# EAGLE design Cpu_digout_mega128 (EAGLE 4.11)
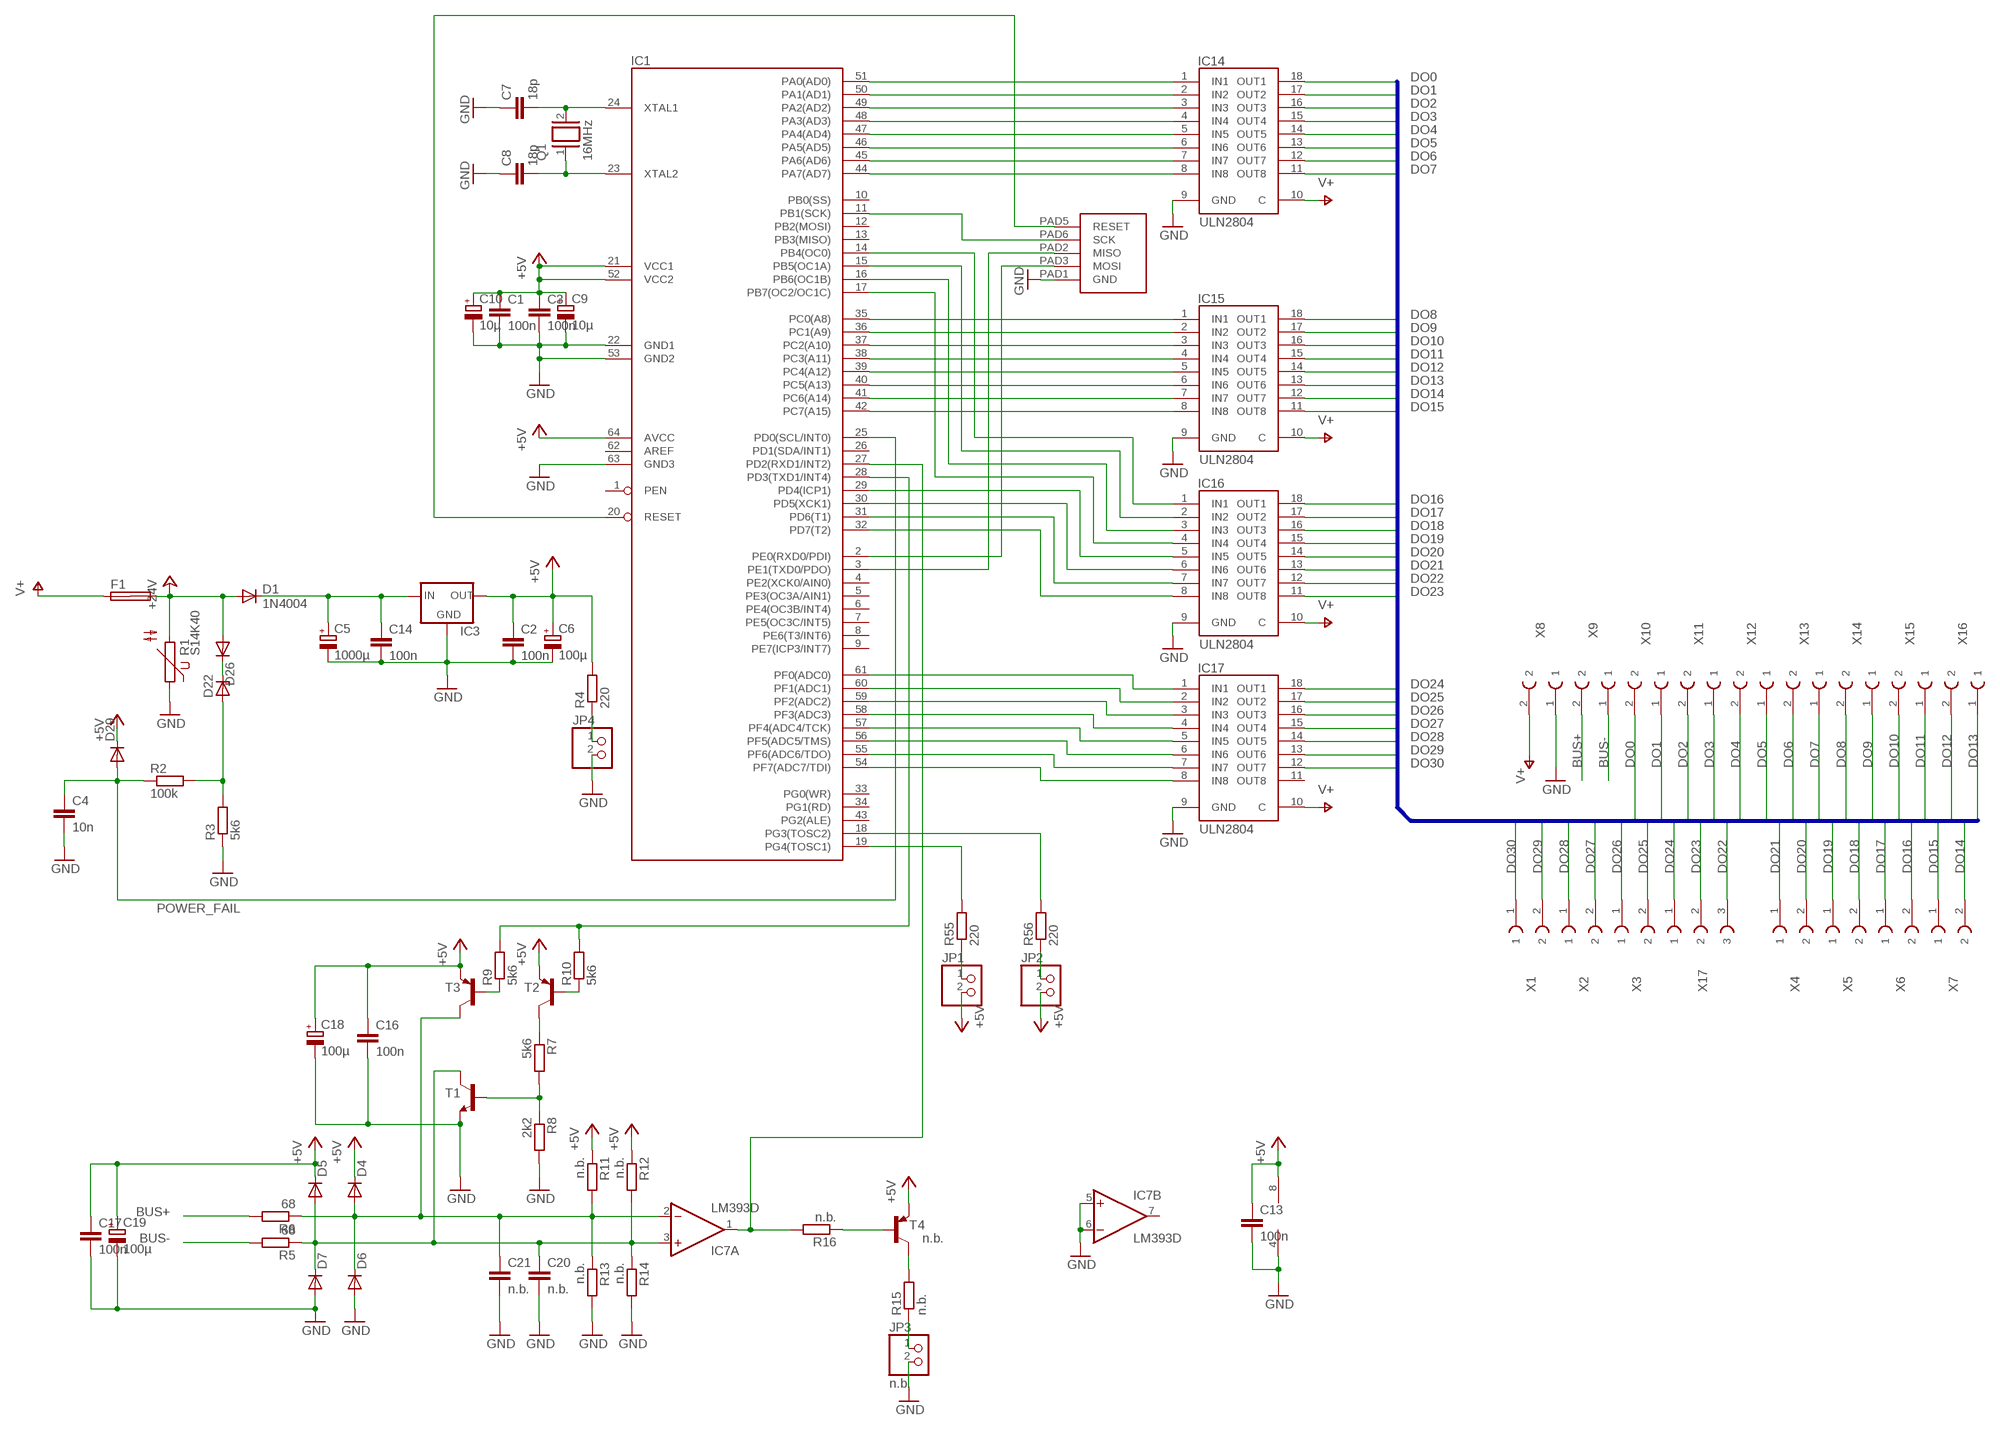
[diagram p0: schematic, sheet 1]

## Parts
C1  100n  C-EU050-024X044  [C050-024X044]
C2  100n  C-EU050-024X044  [C050-024X044]
C3  100n  C-EU050-024X044  [C050-024X044]
C4  10n  C-EU050-024X044  [C050-024X044]
C5  1000µ  CPOL-EUE5-13  [E5-13]
C6  100µ  CPOL-EUE2.5-6  [E2,5-6]
C7  18p  C-EU025-024X044  [C025-024X044]
C8  18p  C-EU025-024X044  [C025-024X044]
C9  10µ  CPOL-EUE2-5  [E2-5]
C10  10µ  CPOL-EUE2-5  [E2-5]
C13  100n  C-EU050-024X044  [C050-024X044]
C14  100n  C-EU050-024X044  [C050-024X044]
C16  100n  C-EU050-024X044  [C050-024X044]
C17  100n  C-EU050-024X044  [C050-024X044]
C18  100µ  CPOL-EUE2.5-6  [E2,5-6]
C19  100µ  CPOL-EUE2.5-6  [E2,5-6]
C20  n.b.  C-EU050-024X044  [C050-024X044]
C21  n.b.  C-EU050-024X044  [C050-024X044]
D1  1N4004  [DO41-10]
D4  DIODE-D-2.5  [D-2.5]
D5  DIODE-D-2.5  [D-2.5]
D6  DIODE-D-2.5  [D-2.5]
D7  DIODE-D-2.5  [D-2.5]
D22  ZENER-DIODEZD-2.5  [ZDIO-2.5]
D26  DIODE-D-2.5  [D-2.5]
D29  DIODE-D-2.5  [D-2.5]
F1  SHK20L  [SHK20L]
IC1  ATMEGA128  [TQFP64]
IC3  7805  [TO220V]
IC7  LM393D  [SO08]
IC14  ULN2804  ULN2801  [DIL18]
IC15  ULN2804  ULN2801  [DIL18]
IC16  ULN2804  ULN2801  [DIL18]
IC17  ULN2804  ULN2801  [DIL18]
JP1  PINHD-1X2  [1X02]
JP2  PINHD-1X2  [1X02]
JP3  n.b.  PINHD-1X2  [1X02]
JP4  PINHD-1X2  [1X02]
Q1  16MHz  XTAL/S  [QS]
R1  S14K40  [S14K40]
R2  100k  R-EU_0207/2V  [0207/2V]
R3  5k6  R-EU_0207/2V  [0207/2V]
R4  220  R-EU_0207/2V  [0207/2V]
R5  68  R-EU_0207/2V  [0207/2V]
R6  68  R-EU_0207/2V  [0207/2V]
R7  5k6  R-EU_0207/2V  [0207/2V]
R8  2k2  R-EU_0207/2V  [0207/2V]
R9  5k6  R-EU_0207/2V  [0207/2V]
R10  5k6  R-EU_0207/2V  [0207/2V]
R11  n.b.  R-EU_0207/2V  [0207/2V]
R12  n.b.  R-EU_0207/2V  [0207/2V]
R13  n.b.  R-EU_0207/2V  [0207/2V]
R14  n.b.  R-EU_0207/2V  [0207/2V]
R15  n.b.  R-EU_0207/2V  [0207/2V]
R16  n.b.  R-EU_0207/2V  [0207/2V]
R55  220  R-EU_0207/2V  [0207/2V]
R56  220  R-EU_0207/2V  [0207/2V]
T1  BC546A-NPN-TO92-EBC  [TO92-EBC]
T2  BC556A-PNP-TO92-EBC  [TO92-EBC]
T3  BC556A-PNP-TO92-EBC  [TO92-EBC]
T4  n.b.  BC556A-PNP-TO92-EBC  [TO92-EBC]
U$1  ATMEL_ISP  [ATMEL_ISP]
X1  AR-KLEMME_508_2POL  [W237-2E]
X2  AR-KLEMME_508_2POL  [W237-2E]
X3  AR-KLEMME_508_2POL  [W237-2E]
X4  AR-KLEMME_508_2POL  [W237-2E]
X5  AR-KLEMME_508_2POL  [W237-2E]
X6  AR-KLEMME_508_2POL  [W237-2E]
X7  AR-KLEMME_508_2POL  [W237-2E]
X8  AR-KLEMME_508_2POL  [W237-2E]
X9  AR-KLEMME_508_2POL  [W237-2E]
X10  AR-KLEMME_508_2POL  [W237-2E]
X11  AR-KLEMME_508_2POL  [W237-2E]
X12  AR-KLEMME_508_2POL  [W237-2E]
X13  AR-KLEMME_508_2POL  [W237-2E]
X14  AR-KLEMME_508_2POL  [W237-2E]
X15  AR-KLEMME_508_2POL  [W237-2E]
X16  AR-KLEMME_508_2POL  [W237-2E]
X17  AR-KLEMME_508_3POL  [W237-3E]

## Nets
+5V: C1.1 C2.1 C3.1 C6.+ C9.+ C10.+ C13.1 C16.1 C17.1 C18.+ C19.+ D4.C D5.C D29.C IC1.21(VCC1) IC1.52(VCC2) IC1.64(AVCC) IC3.3(OUT) IC7.8(P:V+) JP1.2 JP2.2 R4.2 R11.1 R12.1 T2.E T3.E T4.E
+24V: D1.A D26.A F1.2A R1.2
/RESET: IC1.20(RESET) U$1.PAD5(RESET)
B+: C21.1 D4.A D6.C IC7.2(A:-IN) R6.1 R11.2 R13.1 T3.C
B-: C20.1 D5.A D7.C IC7.3(A:+IN) R5.1 R12.2 R14.1 T1.C
BUS+: R6.2 X9.2
BUS-: R5.2 X9.1
DAC0: IC1.51(PA0(AD0)) IC14.1(IN1)
DAC1: IC1.50(PA1(AD1)) IC14.2(IN2)
DAC2: IC1.49(PA2(AD2)) IC14.3(IN3)
DAC3: IC1.48(PA3(AD3)) IC14.4(IN4)
DAC4: IC1.47(PA4(AD4)) IC14.5(IN5)
DAC5: IC1.46(PA5(AD5)) IC14.6(IN6)
DAC6: IC1.45(PA6(AD6)) IC14.7(IN7)
DAC7: IC1.44(PA7(AD7)) IC14.8(IN8)
DO0: IC14.18(OUT1) X10.2
DO1: IC14.17(OUT2) X10.1
DO2: IC14.16(OUT3) X11.2
DO3: IC14.15(OUT4) X11.1
DO4: IC14.14(OUT5) X12.2
DO5: IC14.13(OUT6) X12.1
DO6: IC14.12(OUT7) X13.2
DO7: IC14.11(OUT8) X13.1
DO8: IC15.18(OUT1) X14.2
DO9: IC15.17(OUT2) X14.1
DO10: IC15.16(OUT3) X15.2
DO11: IC15.15(OUT4) X15.1
DO12: IC15.14(OUT5) X16.2
DO13: IC15.13(OUT6) X16.1
DO14: IC15.12(OUT7) X7.2
DO15: IC15.11(OUT8) X7.1
DO16: IC16.18(OUT1) X6.2
DO17: IC16.17(OUT2) X6.1
DO18: IC16.16(OUT3) X5.2
DO19: IC16.15(OUT4) X5.1
DO20: IC16.14(OUT5) X4.2
DO21: IC16.13(OUT6) X4.1
DO22: IC16.12(OUT7) X17.3
DO23: IC16.11(OUT8) X17.2
DO24: IC17.18(OUT1) X17.1
DO25: IC17.17(OUT2) X3.2
DO26: IC17.16(OUT3) X3.1
DO27: IC17.15(OUT4) X2.2
DO28: IC17.14(OUT5) X2.1
DO29: IC17.13(OUT6) X1.2
DO30: IC17.12(OUT7) X1.1
GND: C1.2 C2.2 C3.2 C4.2 C5.- C6.- C7.1 C8.1 C9.- C10.- C13.2 C14.2 C16.2 C17.2 C18.- C19.- C20.2 C21.2 D6.A D7.A IC1.22(GND1) IC1.53(GND2) IC1.63(GND3) IC3.2(GND) IC7.4(P:V-) IC7.5(B:+IN) IC7.6(B:-IN) IC14.9(GND) IC15.9(GND) IC16.9(GND) IC17.9(GND) JP3.2 JP4.2 R1.1 R3.1 R8.2 R13.2 R14.2 T1.E U$1.PAD1(GND) X8.1
MISO: IC1.3(PE1(TXD0/PDO)) U$1.PAD2(MISO)
MOSI: IC1.2(PE0(RXD0/PDI)) U$1.PAD3(MOSI)
N$1: JP4.1 R4.1
N$2: D22.C D26.C
N$3: D22.A R2.2 R3.2
N$4: C7.2 IC1.24(XTAL1) Q1.2
N$5: IC1.14(PB4(OC0)) IC16.1(IN1)
N$6: C8.2 IC1.23(XTAL2) Q1.1
N$13: R16.1 T4.B
N$14: R15.2 T4.C
N$15: C5.+ C14.1 D1.C IC3.1(IN)
N$16: R10.1 T2.B
N$17: R9.1 T3.B
N$18: R7.1 T2.C
N$19: R7.2 R8.1 T1.B
N$20: IC1.15(PB5(OC1A)) IC16.2(IN2)
N$21: IC1.16(PB6(OC1B)) IC16.3(IN3)
N$22: IC1.17(PB7(OC2/OC1C)) IC16.4(IN4)
N$24: JP3.1 R15.1
N$28: IC1.29(PD4(ICP1)) IC16.5(IN5)
N$29: IC1.30(PD5(XCK1)) IC16.6(IN6)
N$30: IC1.31(PD6(T1)) IC16.7(IN7)
N$31: IC1.32(PD7(T2)) IC16.8(IN8)
N$32: IC1.61(PF0(ADC0)) IC17.1(IN1)
N$33: IC1.60(PF1(ADC1)) IC17.2(IN2)
N$34: IC1.59(PF2(ADC2)) IC17.3(IN3)
N$35: IC1.58(PF3(ADC3)) IC17.4(IN4)
N$36: IC1.57(PF4(ADC4/TCK)) IC17.5(IN5)
N$37: IC1.56(PF5(ADC5/TMS)) IC17.6(IN6)
N$42: IC1.55(PF6(ADC6/TDO)) IC17.7(IN7)
N$43: IC1.54(PF7(ADC7/TDI)) IC17.8(IN8)
N$70: IC1.35(PC0(A8)) IC15.1(IN1)
N$71: IC1.36(PC1(A9)) IC15.2(IN2)
N$72: IC1.37(PC2(A10)) IC15.3(IN3)
N$73: IC1.38(PC3(A11)) IC15.4(IN4)
N$74: IC1.39(PC4(A12)) IC15.5(IN5)
N$75: IC1.40(PC5(A13)) IC15.6(IN6)
N$76: IC1.41(PC6(A14)) IC15.7(IN7)
N$77: IC1.42(PC7(A15)) IC15.8(IN8)
N$113: JP1.1 R55.1
N$114: JP2.1 R56.1
N$115: IC1.19(PG4(TOSC1)) R55.2
N$116: IC1.18(PG3(TOSC2)) R56.2
POWER_FAIL: C4.1 D29.A IC1.25(PD0(SCL/INT0)) R2.1
RXD: IC1.27(PD2(RXD1/INT2)) IC7.1(A:OUT) R16.2
SCK: IC1.11(PB1(SCK)) U$1.PAD6(SCK)
TXD: IC1.28(PD3(TXD1/INT4)) R9.2 R10.2
V+: F1.1A IC14.10(C) IC15.10(C) IC16.10(C) IC17.10(C) X8.2
Unconnected: F1.1B F1.2B IC1.1(PEN) IC1.4(PE2(XCK0/AIN0)) IC1.5(PE3(OC3A/AIN1)) IC1.6(PE4(OC3B/INT4)) IC1.7(PE5(OC3C/INT5)) IC1.8(PE6(T3/INT6)) IC1.9(PE7(ICP3/INT7)) IC1.10(PB0(SS)) IC1.12(PB2(MOSI)) IC1.13(PB3(MISO)) IC1.26(PD1(SDA/INT1)) IC1.33(PG0(WR)) IC1.34(PG1(RD)) IC1.43(PG2(ALE)) IC7.7(B:OUT) IC17.11(OUT8)

## Buses
B$1

## Power pins joined to a net without a drawn wire
AREF: IC1.62(AREF)

## Library data of the parts
C1-C4 C7 C8 C13 C14 C16 C17 C20 C21 = rcl:C-EU: CAPACITOR, European symbol
C5 C6 C9 C10 C18 C19 = rcl:CPOL-EU: POLARIZED CAPACITOR, European symbol
D1 = diode:1N4004: DIODE general purpose rectifier, 1 A
D4-D7 D26 D29 = diode:DIODE-: DIODE
D22 = diode:ZENER-DIODE: Z-Diode
F1 = fuse:SHK20L: FUSE HOLDER 5 x 20 mm, SH contact, SHH1 Schukat, E1073 Buerklin
IC1 = mylib:ATMEGA128
IC3 = mylib:7805
IC7 = linear:LM393: COMPARATOR
IC14-IC17 = mylib:ULN2801
JP1-JP4 = pinhead:PINHD-1X2: PIN HEADER
Q1 = special:XTAL/S: CRYSTAL
R1 = varistor:S14K40: VARISTOR
R2-R16 R55 R56 = rcl:R-EU_: RESISTOR, European symbol
T1 = transistor:*-NPN-: NPN Transistror
T2-T4 = transistor:*-PNP-: PNP Transistror
U$1 = mylib:ATMEL_ISP
X1-X16 = mylib:AR-KLEMME_508_2POL
X17 = mylib:AR-KLEMME_508_3POL

## Board
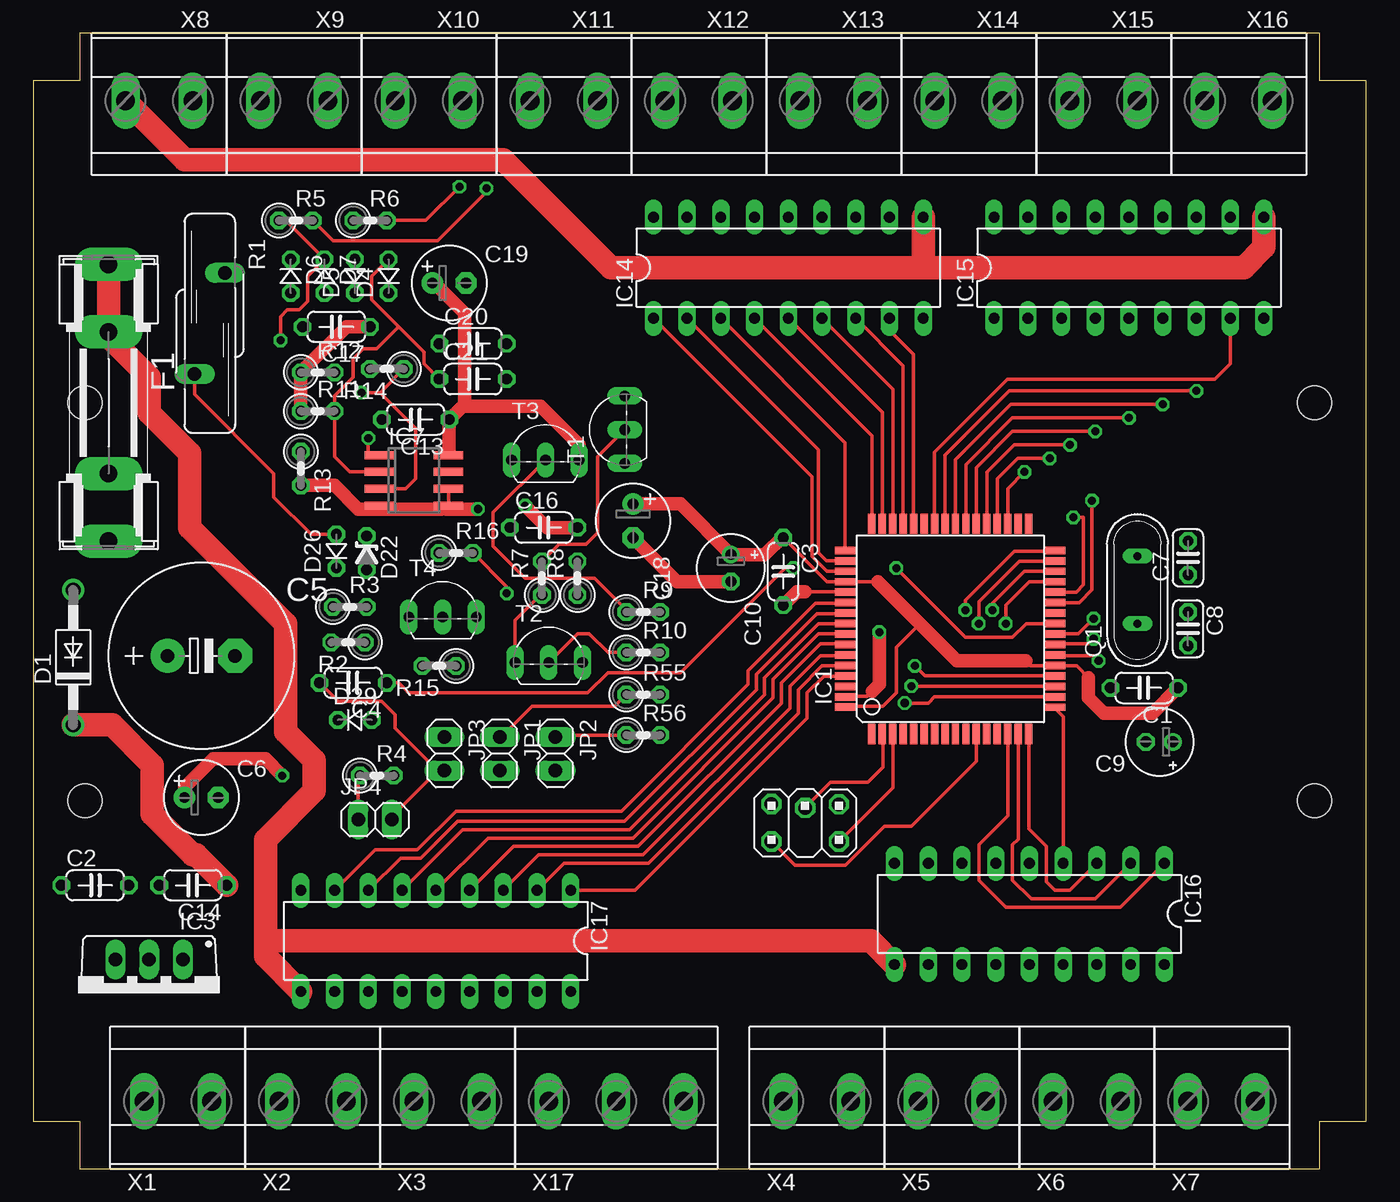
[diagram p1: board, top side]
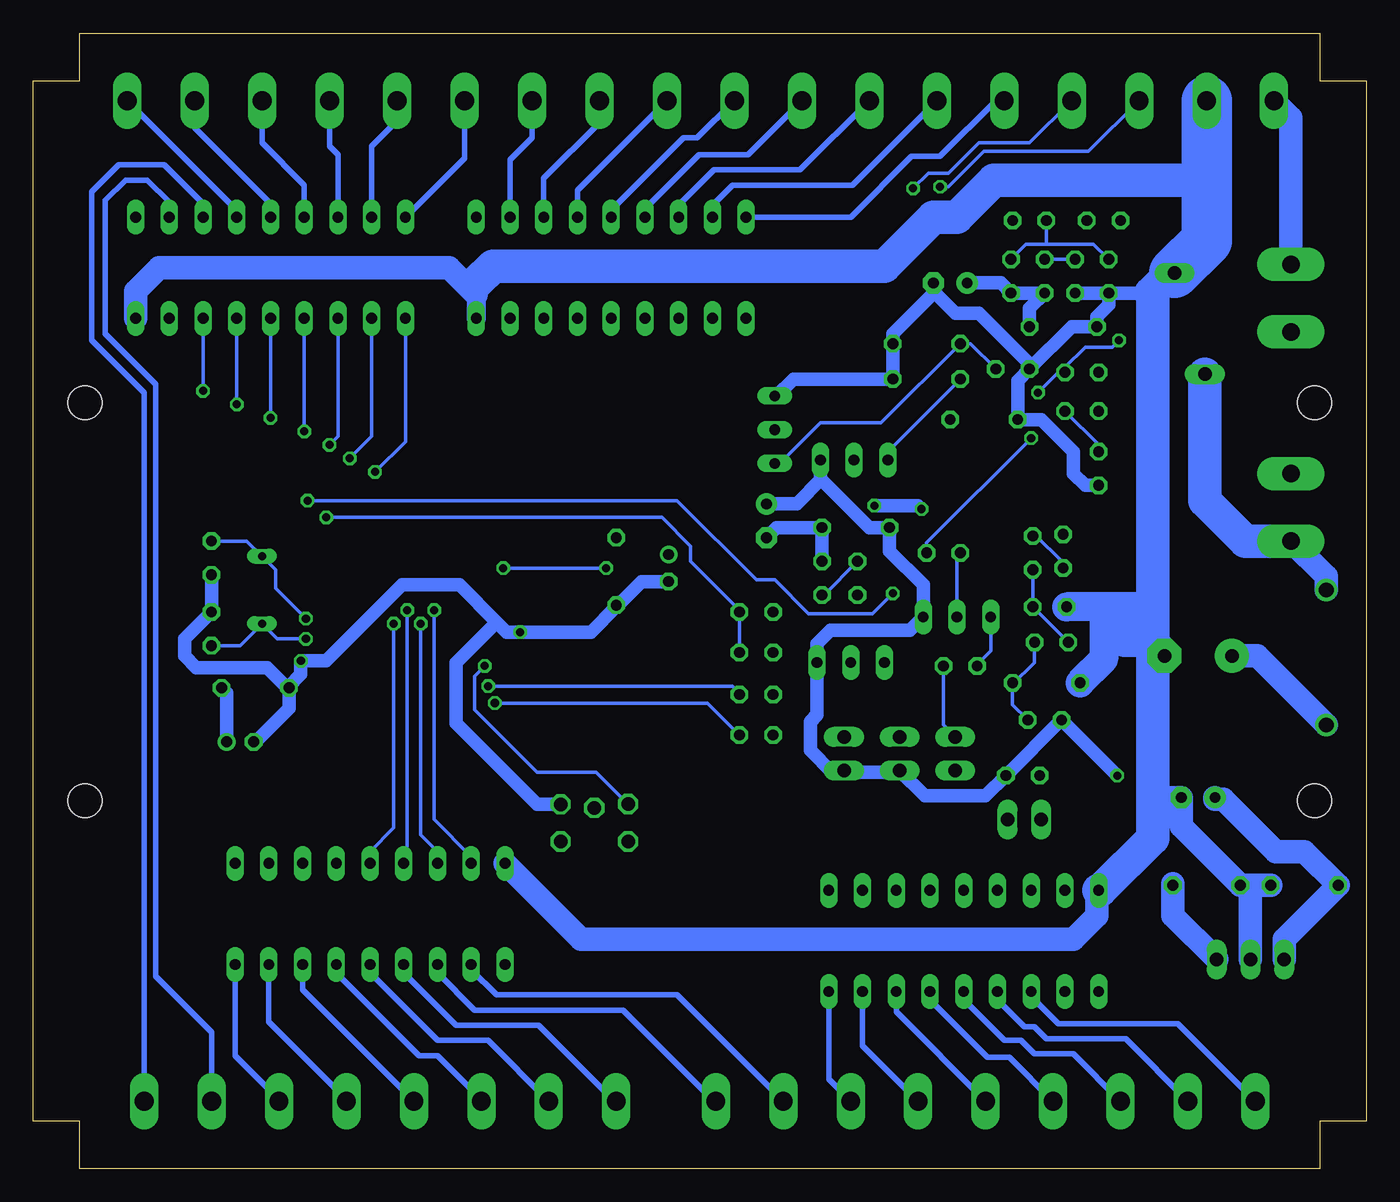
[diagram p2: board, bottom side, seen from below]

Size 100.38 x 85.47 mm. Coordinates in mm from the lower left corner, seen from the top.
Outline: 0,3.56 3.52,3.56 3.52,0 96.86,0 96.86,3.56 100.38,3.56 100.38,81.91 96.86,81.91 96.86,85.47 3.52,85.47 3.52,81.91 0,81.91 0,3.56
Copper layers (1*16): Top 0.035mm / dielectric 1.5mm / Bottom 0.035mm
Design rules "default": minimum track width 10mil, minimum drill 24mil, track to track 8mil, track to pad 8mil, pad to pad 8mil, via to via 8mil, smd to smd 8mil, copper to edge 40mil, drill to drill 8mil, minimum pad ring 10mil, minimum via ring 8mil, stop-mask expansion 4mil, vias tented up to drill 0mil, thermal gap 10mil
Holes 2.54 mm at 96.48,57.66 96.48,27.69 3.9,57.66 3.9,27.69

### Footprints (pad centres in the part's own frame; a part is rotated, then mirrored left to right if it is on the bottom)
C050-024X044 = drill 0.813 octagon: 1 -2.54,0; 2 2.54,0
E5-13 = drill 1.016 pad 2.54 round: + -2.54,0 | drill 1.016 pad 2.54 octagon: - 2.54,0
E2,5-6 = drill 0.813 pad 1.6 round: + -1.27,0 | drill 0.813 pad 1.6 octagon: - 1.27,0
C025-024X044 = drill 0.813 octagon: 1 -1.27,0; 2 1.27,0
E2-5 = drill 0.813 pad 1.27 round: + -1.016,0 | drill 0.813 pad 1.27 octagon: - 1.016,0
DO41-10 = drill 1.118 round: A 5.08,0; C -5.08,0
D-2.5 = drill 0.813 octagon: A 1.27,0; C -1.27,0
ZDIO-2.5 = drill 0.813 octagon: A 1.27,0; C -1.27,0
SHK20L = drill 1.321 pad 2.54 long: 1A -10.414,0; 1B -5.334,0; 2A 10.414,0; 2B 5.334,0
TQFP64 = smd 1.524 x 0.559: 1 -7.912,5.905; 2 -7.912,5.118; 3 -7.912,4.331; 4 -7.912,3.543; 5 -7.912,2.756; 6 -7.912,1.968; 7 -7.912,1.181; 8 -7.912,0.394; 9 -7.912,-0.394; 10 -7.912,-1.181; 11 -7.912,-1.968; 12 -7.912,-2.756; 13 -7.912,-3.543; 14 -7.912,-4.331; 15 -7.912,-5.118; 16 -7.912,-5.905; 33 7.912,-5.905; 34 7.912,-5.118; 35 7.912,-4.331; 36 7.912,-3.543; 37 7.912,-2.756; 38 7.912,-1.968; 39 7.912,-1.181; 40 7.912,-0.394; 41 7.912,0.394; 42 7.912,1.181; 43 7.912,1.968; 44 7.912,2.756; 45 7.912,3.543; 46 7.912,4.331; 47 7.912,5.118; 48 7.912,5.905 | smd 0.559 x 1.524: 17 -5.905,-7.912; 18 -5.118,-7.912; 19 -4.331,-7.912; 20 -3.543,-7.912; 21 -2.756,-7.912; 22 -1.968,-7.912; 23 -1.181,-7.912; 24 -0.394,-7.912; 25 0.394,-7.912; 26 1.181,-7.912; 27 1.968,-7.912; 28 2.756,-7.912; 29 3.543,-7.912; 30 4.331,-7.912; 31 5.118,-7.912; 32 5.905,-7.912; 49 5.905,7.912; 50 5.118,7.912; 51 4.331,7.912; 52 3.543,7.912; 53 2.756,7.912; 54 1.968,7.912; 55 1.181,7.912; 56 0.394,7.912; 57 -0.394,7.912; 58 -1.181,7.912; 59 -1.968,7.912; 60 -2.756,7.912; 61 -3.543,7.912; 62 -4.331,7.912; 63 -5.118,7.912; 64 -5.88,7.912
TO220V = drill 1.016 long: 1 -2.54,-2.54; 2 0,-2.54; 3 2.54,-2.54
SO08 = smd 0.6 x 2.2: 1 -1.905,-2.6; 2 -0.635,-2.6; 3 0.635,-2.6; 4 1.905,-2.6; 5 1.905,2.6; 6 0.635,2.6; 7 -0.635,2.6; 8 -1.905,2.6
DIL18 = drill 0.813 long: 1 -10.16,-3.81; 2 -7.62,-3.81; 3 -5.08,-3.81; 4 -2.54,-3.81; 5 0,-3.81; 6 2.54,-3.81; 7 5.08,-3.81; 8 7.62,-3.81; 9 10.16,-3.81; 10 10.16,3.81; 11 7.62,3.81; 12 5.08,3.81; 13 2.54,3.81; 14 0,3.81; 15 -2.54,3.81; 16 -5.08,3.81; 17 -7.62,3.81; 18 -10.16,3.81
1X02 = drill 1.016 long: 1 -1.27,0; 2 1.27,0
QS = drill 0.61 long: 1 -2.54,0; 2 2.54,0
S14K40 = drill 1.016 long: 1 -1.143,-3.81; 2 1.143,3.81
0207/2V = drill 0.813 octagon: 1 -1.27,0; 2 1.27,0
TO92-EBC = drill 0.813 long: B 0,-1.27; C -2.54,-1.27; E 2.54,-1.27
ATMEL_ISP = drill 1.016 octagon: PAD1 1.397,-2.54; PAD2 -1.41,-2.54; PAD3 1.13,0; PAD5 1.41,2.54; PAD6 -1.41,2.54
W237-2E = drill 1.422 long: 1 -2.54,0; 2 2.54,0
W237-3E = drill 1.422 long: 1 -5.08,0; 2 0,0; 3 5.08,0

### Placement (x,y rotation side)
C1  83.66,36.2 180 top
C2  4.66,21.34 0 top
C3  56.48,44.96 270 top
C4  24.09,36.58 180 top
C5  12.66,38.61 0 top
C6  12.66,27.94 0 top
C7  86.96,45.97 90 top
C8  86.96,40.64 270 top
C9  84.8,32.13 180 top
C10  52.54,45.21 270 top
C13  28.79,56.39 180 top
C14  12.03,21.34 180 top
C16  38.44,48.26 0 top
C17  22.82,63.37 180 top
C18  45.17,48.77 270 top
C19  31.33,66.67 0 top
C20  33.11,62.1 0 top
C21  33.11,59.44 0 top
D1  3.01,38.48 90 top
D4  26.76,67.18 90 top
D5  24.22,67.18 90 top
D6  19.39,67.18 270 top
D7  21.93,67.18 270 top
D22  25.11,46.35 270 top
D26  22.82,46.48 90 top
D29  24.22,33.78 0 top
F1  5.68,57.66 270 top
IC1  69.05,40.64 90 top
IC3  8.72,13.21 180 top
IC7  28.66,51.82 270 top
IC14  56.86,67.82 0 top
IC15  82.51,67.82 0 top
IC16  75.02,19.18 180 top
IC17  30.32,17.14 180 top
JP1  35.14,31.24 270 top
JP2  39.33,31.24 270 top
JP3  30.95,31.24 270 top
JP4  25.74,26.29 0 top
Q1  83.15,43.56 90 top
R1  13.3,63.63 180 top
R2  23.71,39.62 180 top
R3  23.84,42.29 0 top
R4  25.87,29.59 0 top
R5  19.77,71.37 0 top
R6  25.36,71.37 0 top
R7  38.32,44.45 90 top
R8  40.98,44.45 90 top
R9  45.94,41.91 0 top
R10  45.94,38.86 0 top
R11  21.43,57.02 0 top
R12  21.43,59.94 0 top
R13  20.16,52.7 270 top
R14  26.63,60.2 180 top
R15  30.57,37.85 180 top
R16  31.84,46.35 0 top
R55  45.94,35.69 0 top
R56  45.94,32.64 0 top
T1  43.27,55.63 90 top
T2  38.82,39.37 0 top
T3  38.57,54.61 0 top
T4  30.82,42.8 0 top
U$1  58.13,26.04 90 top
X1  10.88,5.08 0 top
X2  21.04,5.08 0 top
X3  31.2,5.08 0 top
X4  59.02,5.08 0 top
X5  69.18,5.08 0 top
X6  79.34,5.08 0 top
X7  89.5,5.08 0 top
X8  9.49,80.39 180 top
X9  19.65,80.39 180 top
X10  29.81,80.39 180 top
X11  39.97,80.39 180 top
X12  50.13,80.39 180 top
X13  60.29,80.39 180 top
X14  70.45,80.39 180 top
X15  80.61,80.39 180 top
X16  90.77,80.39 180 top
X17  43.9,5.08 0 top

### Tracks (layer width: path | path; a pad name or v marks a point on that pad's centre or on a via)
+5V  (via drill 0.61)
  Top 0.254: 79.46,36.96 78.58,37.85 76.92,37.85 | C3.1 59.78,44.2 61.18,44.2 | 74.64,38.23 74.89,37.97 74.94,37.97 75.07,37.85 76.92,37.85 | 66.76,41.02 64.99,39.24 64.99,35.81 63.97,34.8 61.18,34.8 IC1.64 | IC7.8 31.33,53.79 31.33,53.98 | 61.18,44.2 61.16,44.18 IC1.52 | 61.18,44.2 63.59,44.2 | 76.92,37.85 IC1.21
  Top 1.016: C1.1 84.29,34.29 80.61,34.29 79.46,35.43 79.46,36.96 | 74.77,38.23 74.64,38.23 69.56,38.23 66.76,41.02 63.59,44.2 | C17.1 23.58,63.37 R12.1 R11.1 | C13.1 32.47,57.53 32.47,64.39 30.06,66.8 C19.+ | C13.1 31.33,53.98 | T3.E 41.11,54.48 38.19,57.4 32.35,57.4 C13.1 | C3.1 56.48,47.62 55.08,46.23 C10.+ 48.73,50.04 C18.+ | v18.76,29.59 17.49,30.86 13.55,30.86 11.39,28.7 C6.+
  Bottom 1.016: D5.C D4.C 27.52,66.67 C19.+ | C17.1 25.36,64.77 D5.C | D5.C 24.35,66.04 | C9.+ 85.81,35.81 C1.1 | JP1.2 35.14,30.1 | 39.33,29.84 JP2.2 | JP1.2 35.27,29.84 39.33,29.84 | 39.33,29.84 40.22,29.84 41.87,31.5 41.87,33.66 41.36,34.16 T2.E 41.36,39.5 40.35,40.51 34.38,40.51 T4.E 33.36,43.94 35.9,46.48 C16.1 37.43,48.26 41.05,51.88 | T3.E 41.11,51.94 41.05,51.88 | C18.+ 42.89,50.04 41.05,51.88 | v18.76,29.59 D29.C R4.2 28.66,28.07 33.24,28.07 JP1.2
  Bottom 1.778: C6.+ 11.39,27.81 10.76,27.81 6.82,23.88 4.66,23.88 C2.1 6.18,17.27 IC3.3
+24V
  Top 0.254: D26.A 20.92,47.75 18.12,50.55 18.12,52.32 12.15,58.29 R1.2
  Bottom 1.778: F1.2A 3.01,44.58 D1.A
  Bottom 2.54: F1.2A 9.11,47.24 12.15,50.29 R1.2
/RESET  (via drill 0.61)
  Top 0.254: IC1.20 67.13,37.1 v66.38,37.85
  Bottom 0.254: v66.38,37.85 67.15,37.08 67.15,34.54 62.45,29.84 58,29.84 55.59,27.43 U$1.PAD5
B+
  Top 0.254: 27.52,63.37 25.87,61.72 24.85,61.72 24.09,60.96 24.09,59.56 22.7,58.17 R11.2 22.7,53.59 23.84,52.45 IC7.2 | 27.52,63.37 25.49,65.41 25.49,67.18 D4.A | 27.52,63.37 29.43,61.47 29.43,60.58 C21.1
  Bottom 0.254: R13.1 20.16,54.48 R11.2 | C21.1 36.03,53.98 T3.C | 24.09,69.6 R6.1 | D4.A 25.62,69.6 24.09,69.6 | 24.09,69.6 20.54,69.6 D6.C
B-  (via drill 0.61)
  Top 0.254: v18.63,62.36 18.63,64.13 19.14,64.64 20.03,64.64 20.66,65.28 20.66,67.18 D7.C 19.01,71.37 R5.1 | 26.12,58.42 R14.1 | 26.12,58.42 v24.73,58.42 | IC7.3 28.03,51.18 28.79,51.94 28.79,55.75 26.12,58.42
  Bottom 0.254: v18.63,62.36 19.14,61.85 21.17,61.85 22.7,60.33 R12.2 23.2,59.94 v24.73,58.42 | R14.1 29.81,62.1 C20.1 36.54,56.13 41.11,56.13 44.16,53.09 T1.C | D7.C D5.A
BUS+  (via drill 0.61)
  Top 0.254: R6.2 29.55,71.37 v32.09,73.91
  Bottom 0.254: v32.09,73.91 31.46,73.91 28.79,76.58 20.92,76.58 X9.2
BUS-  (via drill 0.61)
  Top 0.254: R5.2 22.57,69.85 30.44,69.85 34.12,73.53 v34.12,73.79
  Bottom 0.254: v34.12,73.79 32.98,74.93 31.46,74.93 29.17,77.22 25.36,77.22 X9.1
DAC0
  Top 0.254: IC1.51 59.77,44.97 58.64,46.1 58.64,52.07 IC14.1
DAC1
  Top 0.254: IC1.50 59.74,45.76 59.14,46.35 59.14,54.1 IC14.2
DAC2
  Top 0.254: IC1.49 61.14,54.65 IC14.3
DAC3
  Top 0.254: IC1.48 63.14,55.18 IC14.4
DAC4
  Top 0.254: IC1.47 63.93,56.93 IC14.5
DAC5
  Top 0.254: IC1.46 64.72,58.69 IC14.6
DAC6
  Top 0.254: IC1.45 65.51,60.44 IC14.7
DAC7
  Top 0.254: IC1.44 66.29,61.3 64.48,63.12 IC14.8
DO0
  Bottom 0.406: IC14.18 38.82,71.63 34.25,76.2 32.09,76.2 27.9,80.39 X10.2
DO1
  Bottom 0.406: IC14.17 49.24,72.52 47.71,74.04 38.7,74.04 X10.1
DO2
  Bottom 0.406: IC14.16 51.78,72.52 49.11,75.18 42.63,75.18 X11.2
DO3
  Bottom 0.406: IC14.15 54.32,72.26 50.25,76.33 46.57,76.33 X11.1
DO4
  Bottom 0.406: IC14.14 56.86,72.14 51.4,77.6 50.38,77.6 X12.2
DO5
  Bottom 0.406: IC14.13 59.4,73.66 X12.1
DO6
  Bottom 0.406: IC14.12 61.94,74.55 57.75,78.74 X13.2
DO7
  Bottom 0.406: IC14.11 64.48,75.95 62.83,77.6 X13.1
DO8
  Bottom 0.406: IC15.18 67.91,76.07 X14.2
DO9
  Bottom 0.406: IC15.17 74.89,76.96 72.99,78.87 X14.1
DO10
  Bottom 0.406: IC15.16 77.43,76.33 78.07,76.96 X15.2
DO11
  Bottom 0.406: IC15.15 79.97,74.04 83.15,77.22 X15.1
DO12
  Bottom 0.406: IC15.14 82.51,72.64 88.23,78.36 X16.2
DO13
  Bottom 0.406: IC15.13 85.05,72.14 X16.1
DO14
  Bottom 0.406: IC15.12 87.59,72.64 90.51,75.56 93.94,75.56 95.97,73.53 95.97,62.36 92.04,58.42 X7.2
DO15
  Bottom 0.406: IC15.11 90.13,72.77 91.78,74.42 93.43,74.42 94.96,72.9 94.96,62.87 91.15,59.05 91.15,14.48 86.96,10.29 X7.1
DO16
  Bottom 0.406: X6.2 81.88,5.21 85.18,8.51 IC16.18
DO17
  Bottom 0.406: X6.1 76.8,5.21 82.64,11.05 IC16.17
DO18
  Bottom 0.406: IC16.16 80.1,13.46 X5.2
DO19
  Bottom 0.406: IC16.15 77.56,14.73 71.34,8.51 69.94,8.51 66.76,5.33 66.76,5.21 X5.1
DO20
  Bottom 0.406: IC16.14 75.02,14.73 69.94,9.65 66.13,9.65 X4.2
DO21
  Bottom 0.406: IC16.13 72.48,14.73 68.54,10.79 62.32,10.79 56.6,5.08 X4.1
DO22
  Bottom 0.406: IC16.12 69.94,14.73 67.15,11.94 55.97,11.94 49.11,5.08 X17.3
DO23
  Bottom 0.406: IC16.11 67.4,14.99 65.49,13.08 51.91,13.08 X17.2
DO24
  Bottom 0.406: IC17.18 40.48,6.73 X17.1
DO25
  Bottom 0.406: IC17.17 37.94,9.27 X3.2
DO26
  Bottom 0.406: IC17.16 35.4,11.81 X3.1
DO27
  Bottom 0.406: IC17.15 32.86,12.7 28.54,8.38 26.89,8.38 X2.2
DO28
  Bottom 0.406: IC17.14 30.32,12.7 27.27,9.65 26,9.65 24.98,8.64 22.06,8.64 X2.1
DO29
  Bottom 0.406: IC17.13 27.77,12.7 25.74,10.67 24.98,10.67 24.09,9.78 18.12,9.78 X1.2
DO30
  Bottom 0.406: IC17.12 25.23,12.95 23.2,10.92 14.19,10.92 X1.1
GND  (via drill 0.61)
  Top 0.254: IC1.63 61.39,35.52 61.43,35.56 62.83,35.56 63.21,35.94 | 30.7,49.66 30.95,49.91 31.2,49.91 | 31.26,51.25 IC7.6 | 31.26,51.25 IC7.5 31.2,49.91 | 31.26,51.25 31.2,51.31 | 31.08,49.66 31.08,49.78 31.2,49.91 | 30.44,29.97 JP3.2 | 30.44,29.97 27.27,33.15 27.27,34.16 26.25,35.18 22.95,35.18 C4.2 | 30.44,29.97 27.01,26.54 JP4.2 | v80.23,38.23 79.84,38.61 76.92,38.61 76.96,38.65 IC1.22 | IC1.53 61.18,43.43 58.13,43.43 | IC7.4 26.12,49.91 26.12,49.66
  Top 1.016: C3.2 57.49,43.43 58.13,43.43 | 63.21,35.94 63.72,36.45 v63.72,40.39 | C18.- 48.48,44.2 C10.- | 30.7,49.66 26.12,49.66 24.47,49.66 22.7,51.44 R13.2 | C16.2 38.7,48.26 v37.05,49.91 | 31.08,49.66 v33.49,49.66
  Bottom 1.016: C7.1 C8.1 88.99,39.88 88.99,38.61 88.1,37.72 82.77,37.72 81.24,36.2 C1.2 | U$1.PAD1 62.45,27.43 68.54,33.53 68.54,38.1 65.49,41.15 | C1.2 81.12,36.32 80.23,37.21 v80.23,38.23 78.32,38.23 72.61,43.94 68.29,43.94 65.49,41.15 | D6.A D7.A | D6.A 19.39,65.02 20.28,64.13 C17.2 22.19,63.37 R14.2 | 32.6,66.04 C19.- | 32.6,66.04 32.6,65.91 35.65,62.87 C20.2 C21.2 43.14,59.44 44.41,58.17 T1.E | 16.22,65.91 D6.A | 32.6,66.04 30.95,64.39 29.17,64.39 25.36,60.58 R14.2 | R14.2 26.25,59.31 C13.2 24.47,56.39 22.06,53.98 22.06,52.32 21.17,51.44 R13.2 | C9.- 83.78,32 81.12,34.67 C1.2 | C10.- 54.57,44.2 56.35,42.42 C3.2 56.48,42.29 58.38,40.39 v63.72,40.39 64.73,40.39 65.49,41.15 | R8.2 C16.2 44.41,48.26 C18.- | v37.05,49.91 33.74,49.91 v33.49,49.66
  Bottom 1.422: 67.02,65.79 IC14.9
  Bottom 1.778: C14.2 C2.2 | IC15.9 92.67,66.04 90.89,67.82 69.05,67.82 67.02,65.79 67.02,66.67 | IC16.9 59.14,17.27 22.06,17.27 20.28,19.05 20.28,20.7 20.16,20.83 IC17.9 | 16.22,27.94 16.09,27.94 C6.- 13.93,25.78 C14.2 | C14.2 8.72,21.34 IC3.2
  Bottom 2.184: 19.77,42.29 R3.1 | 16.09,42.29 18.25,42.29 | 17.36,39.62 18.25,39.62 18.25,42.29 | 18.25,42.29 19.77,42.29 | C4.2 19.77,38.35 19.77,42.29
  Bottom 2.54: 67.02,66.67 65.75,67.94 36.28,67.94 32.6,71.63 30.82,71.63 28.03,74.42 12.03,74.42 | IC17.9 20.03,20.95 16.09,24.89 16.09,27.94 16.09,38.61 C5.- 16.09,39.5 16.09,42.29 16.09,65.91 16.22,65.91 14.69,67.44 R1.1
  Bottom 3.81: X8.1 12.03,74.42 12.03,69.85 R1.1
MISO
  Top 0.254: U$1.PAD2 64.73,28.69 64.73,32.77 64.72,32.75 IC1.3
MOSI
  Top 0.254: U$1.PAD3 58.13,27.18 60.03,29.08 62.84,29.08 63.97,30.21 63.97,32.77 IC1.2
N$1
  Top 0.254: R4.1 24.47,29.59 JP4.1
N$2
  Bottom 0.254: D22.C 24.98,47.75 22.82,45.59 D26.C
N$3
  Bottom 0.254: D22.A R3.2 R2.2
N$4  (via drill 0.61)
  Top 0.254: IC1.24 76.91,40.25 76.92,40.26 78.7,40.26 v79.84,41.4 | C7.2 86.45,47.24
  Bottom 0.254: v79.84,41.4 82.13,43.69 82.13,45.09 Q1.2 84.29,47.24 C7.2
N$5
  Top 0.254: IC1.14 73.38,26.56 71.21,24.38 71.21,21.72 73.24,19.69 81.88,19.69 IC16.1
N$6  (via drill 0.61)
  Top 0.254: v79.84,39.88 79.46,39.5 76.92,39.5 IC1.23
  Bottom 0.254: v79.84,39.88 82,39.88 Q1.1 84.8,39.37 C8.2
N$13
  Bottom 0.254: R16.1 30.82,46.1 T4.B
N$14
  Bottom 0.254: R15.2 29.3,37.97 28.28,38.99 T4.C
N$15
  Top 1.778: D1.C 5.93,33.4 8.98,30.35 8.98,26.67 12.03,23.62 12.28,23.62 C14.1
  Bottom 1.778: D1.C 8.22,38.61 C5.+ | IC3.1 14.57,19.05 C14.1 14.57,21.46
N$16
  Top 0.254: R10.1 43.27,38.86 41.87,40.26 40.98,40.26 T2.B
N$17
  Top 0.254: R9.1 44.67,42.04 42.25,44.45 37.05,44.45 34.63,46.86 34.63,49.4 T3.B
N$18
  Top 0.254: R7.1 38.32,43.31 36.28,41.27 T2.C
N$19
  Top 0.254: T1.B 42.51,53.59 42.51,47.88 41.62,46.99 39.59,46.99 R7.2
  Bottom 0.254: R8.1 40.86,43.18 R7.2
N$20
  Top 0.254: IC1.15 74.17,24.8 73.75,24.38 73.75,21.72 75.15,20.32 79.97,20.32 IC16.2
N$21
  Top 0.254: IC1.16 74.95,25.59 76.29,24.26 76.29,21.59 76.92,20.95 78.07,20.95 IC16.3
N$22
  Top 0.254: IC1.17 76.86,34.73 77.56,34.04 IC16.4
N$24
  Bottom 0.254: R15.1 31.84,33.4 JP3.1
N$28  (via drill 0.61)
  Top 0.254: v73.24,41.02 73.24,42.42 75.02,44.2 76.96,44.2 IC1.29
  Bottom 0.254: IC16.5 75.02,23.88 73.24,25.65 v73.24,41.02
N$29  (via drill 0.61)
  Top 0.254: v72.23,42.04 72.23,42.55 74.64,44.96 76.96,44.96 IC1.30
  Bottom 0.254: IC16.6 72.48,24 72.23,24.26 v72.23,42.04
N$30  (via drill 0.61)
  Top 0.254: v71.21,41.02 71.21,42.67 74.26,45.72 76.96,45.72 IC1.31
  Bottom 0.254: IC16.7 69.94,23.88 71.21,25.15 v71.21,41.02
N$31  (via drill 0.61)
  Top 0.254: v70.19,42.04 70.19,42.8 73.88,46.48 76.96,46.48 IC1.32
  Bottom 0.254: IC16.8 67.4,23.5 70.19,26.29 v70.19,42.04
N$32
  Top 0.254: IC17.1 45.3,20.95 58.26,33.91 58.26,35.81 59.53,37.08 61.18,37.08 61.19,37.1 IC1.61
N$33
  Top 0.254: IC17.2 39.97,22.99 46.32,22.99 57.62,34.29 57.62,36.07 59.4,37.85 61.18,37.85 IC1.60
N$34
  Top 0.254: IC17.3 38.06,23.62 45.94,23.62 56.99,34.67 56.99,36.32 59.27,38.61 61.18,38.61 61.18,38.63 IC1.59
N$35
  Top 0.254: IC17.4 36.16,24.26 45.56,24.26 56.35,35.05 56.35,36.58 59.27,39.5 61.18,39.5 IC1.58
N$36
  Top 0.254: IC17.5 34.25,24.89 45.17,24.89 55.72,35.43 55.72,36.83 59.14,40.26 61.15,40.26 | 61.15,40.26 61.18,40.26 | 61.15,40.26 IC1.57
N$37
  Top 0.254: IC17.6 32.35,25.53 44.92,25.53 55.08,35.69 55.08,36.96 59.14,41.02 61.15,41.02 | 61.15,41.02 61.18,41.02 | 61.15,41.02 IC1.56
N$42
  Top 0.254: IC17.7 27.65,23.37 29.17,23.37 31.97,26.16 44.54,26.16 54.45,36.07 54.45,37.21 59.02,41.78 61.18,41.78 IC1.55
N$43
  Top 0.254: IC17.8 25.74,24 28.92,24 31.84,26.92 44.29,26.92 53.81,36.45 53.81,37.47 58.89,42.55 61.18,42.55 61.18,42.57 IC1.54
N$70  (via drill 0.61)
  Top 0.254: IC1.35 73.38,51.19 v74.64,52.45
  Bottom 0.254: v74.64,52.45 72.35,54.74 IC15.1
N$71  (via drill 0.61)
  Top 0.254: IC1.36 72.59,51.93 74.13,53.47 v76.54,53.47
  Bottom 0.254: v76.54,53.47 74.89,55.12 IC15.2
N$72  (via drill 0.61)
  Top 0.254: IC1.37 71.81,52.41 73.88,54.48 v78.07,54.48
  Bottom 0.254: v78.07,54.48 77.43,55.12 IC15.3
N$73  (via drill 0.61)
  Top 0.254: IC1.38 71.02,52.77 73.75,55.5 v79.97,55.5
  Bottom 0.254: v79.97,55.5 IC15.4
N$74  (via drill 0.61)
  Top 0.254: IC1.39 70.23,53 73.75,56.52 v82.51,56.52
  Bottom 0.254: v82.51,56.52 IC15.5
N$75  (via drill 0.61)
  Top 0.254: IC1.40 69.44,53.35 73.62,57.53 v85.05,57.53
  Bottom 0.254: v85.05,57.53 IC15.6
N$76  (via drill 0.61)
  Top 0.254: IC1.41 68.66,53.71 73.5,58.55 v87.59,58.55
  Bottom 0.254: v87.59,58.55 IC15.7
N$77
  Top 0.254: IC1.42 67.87,53.94 73.37,59.44 88.99,59.44 90.13,60.58 IC15.8
N$113
  Top 0.254: JP1.1 35.14,32.39 37.55,34.8 43.78,34.8 R55.1
N$114
  Top 0.254: 39.21,32.64 39.08,32.64 | JP2.1 39.21,32.64 | 39.21,32.64 R56.1
N$115  (via drill 0.61)
  Top 0.254: IC1.19 66.12,36.31 v66.13,36.32
  Bottom 0.254: R55.2 47.08,35.69 47.71,36.32 v66.13,36.32
N$116  (via drill 0.61)
  Top 0.254: IC1.18 67.87,35.52 67.4,35.05 v65.62,35.05
  Bottom 0.254: v65.62,35.05 49.62,35.05 R56.2
POWER_FAIL  (via drill 0.61)
  Top 0.254: IC1.25 74.78,41.03 73.75,40.01 70.19,40.01 v64.99,45.21 | v57.24,45.21 56.6,45.21 48.73,37.34 43.27,37.34 41.75,35.81 28.28,35.81 27.52,36.58 C4.1
  Bottom 0.254: v57.24,45.21 v64.99,45.21 | 26.63,36.45 C4.1 | R2.1 24.98,38.1 26.63,36.45 | 26.63,36.45 26.63,34.92 D29.A
RXD  (via drill 0.61)
  Top 0.254: IC1.27 78.77,42.61 79.72,43.56 v79.72,50.29 | v35.65,43.31 35.65,43.81 R16.2 | v25.23,54.99 25.23,53.72 IC7.1
  Bottom 0.254: v25.23,54.99 33.11,47.12 R16.2 | v79.72,50.29 51.91,50.29 45.94,44.32 44.54,44.32 42,41.78 37.17,41.78 v35.65,43.31
SCK
  Top 0.254: IC1.11 71.02,30.67 66.13,25.78 64.1,25.78 61.18,22.86 57.37,22.86 55.59,24.64 U$1.PAD6
TXD  (via drill 0.61)
  Top 0.254: IC1.28 78.54,43.4 79.08,43.94 79.08,49.02 v78.32,49.02
  Bottom 0.254: v78.32,49.02 53.05,49.02 50.89,46.86 50.89,45.72 47.21,42.04 R9.2 R10.2
V+
  Top 1.778: IC17.10 17.49,16 17.49,17.14 | 17.49,17.14 17.49,24.77 21.17,28.45 21.17,30.73 19.01,32.89 19.01,41.02 11.77,48.26 11.77,53.85 8.72,56.9 8.72,59.56 5.68,62.61 F1.1A | IC16.10 63.08,17.14 17.49,17.14 | 67.02,67.82 43.52,67.82 35.4,75.95 11.39,75.95 X8.2 | 67.02,67.82 IC14.10 | 67.02,67.82 91.15,67.82 92.67,69.34 IC15.10
  Bottom 1.778: F1.1A 5.68,79.12 X8.2